# Altium schematic sheet mcu.SchDoc: Scalony Skaner Bioimpedancji
size A4; DrawnBy: Łukasz Przeniosło; Organization: Zachodniopomorski; Address1: Uniwersytet Technologiczny; Address2: w Szczecinie; Address3: Wydział Elektryczny; Address4: Katedra KISSE; Revision: 1.0; SheetNumber: 4; SheetTotal: 7
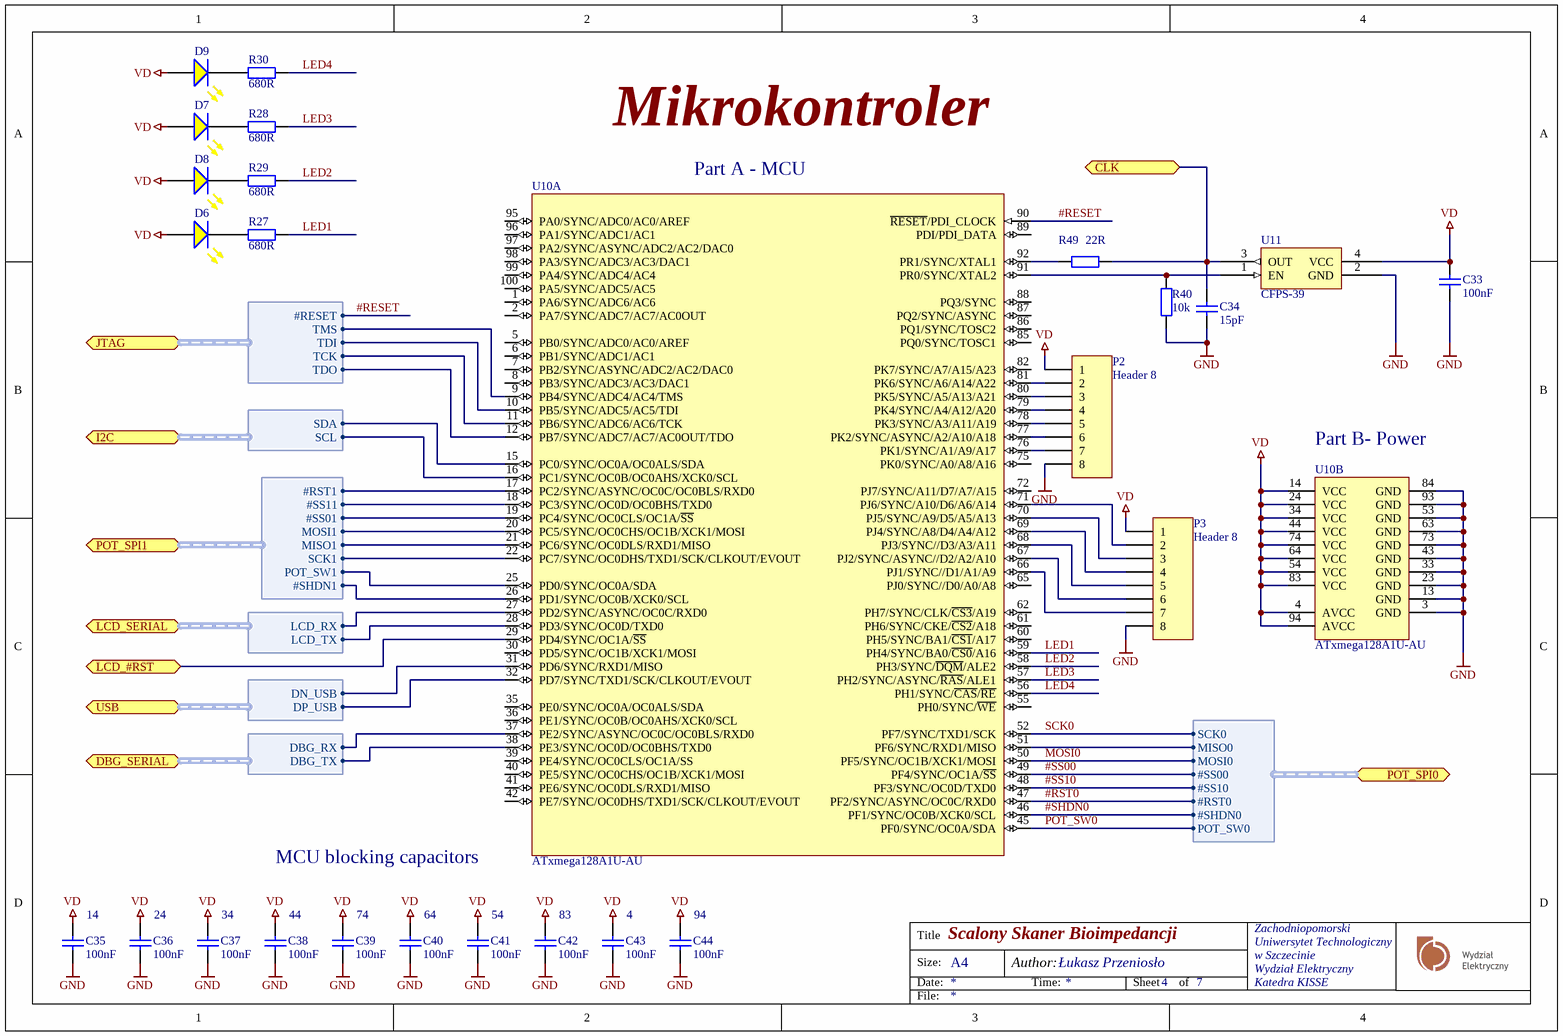
[diagram p0: mcu.SchDoc]

## Parts
C33  100nF  [CAPC1608N]
C34  15pF  [CAPC1608N]
C35  100nF  [CAPC1608N]
C36  100nF  [CAPC1608N]
C37  100nF  [CAPC1608N]
C38  100nF  [CAPC1608N]
C39  100nF  [CAPC1608N]
C40  100nF  [CAPC1608N]
C41  100nF  [CAPC1608N]
C42  100nF  [CAPC1608N]
C43  100nF  [CAPC1608N]
C44  100nF  [CAPC1608N]
D6  LED_YELLOW  [KPA-3010SGD]  (value not drawn)
D7  LED_YELLOW  [KPA-3010SGD]  (value not drawn)
D8  LED_YELLOW  [KPA-3010SGD]  (value not drawn)
D9  LED_YELLOW  [KPA-3010SGD]  (value not drawn)
P2  Header 8  [HDR1X8]
P3  Header 8  [HDR1X8]
R27  680R  [RESC1608N]
R28  680R  [RESC1608N]
R29  680R  [RESC1608N]
R30  680R  [RESC1608N]
R40  10k  [RESC1608N]
R49  22R  [RESC1608N]
U10  ATxmega128A1U-AU  [100A_MOJE]  (parts A,B of 2)
U11  CFPS-39  [ECX32]

## Ports
CLK, DBG_SERIAL (harness DBG_SERIAL), I2C (harness I2C), JTAG (harness JTAG), LCD_#RST, LCD_SERIAL (harness LCD_SERIAL), POT_SPI0 (harness POT_SPI0), POT_SPI1 (harness POT_SPI1), USB (harness USB)

## Harnesses
JTAG: TMS, TCK, TDI, TDO, #RESET
LCD_SERIAL: LCD_TX, LCD_RX
I2C: SDA, SCL
DBG_SERIAL: DBG_TX, DBG_RX
POT_SPI0: MISO0, MOSI0, SCK0, #SS00, #SS10, #RST0, #SHDN0, POT_SW0
USB: DP_USB, DN_USB
POT_SPI1: MISO1, MOSI1, SCK1, #SS01, #SS11, #RST1, #SHDN1, POT_SW1

## Nets
GND: C33.1 C34.1 C35.1 C36.1 C37.1 C38.1 C39.1 C40.1 C41.1 C42.1 C43.1 C44.1 P2.8 P3.8 R40.1 U10.3(GND) U10.13(GND) U10.23(GND) U10.33(GND) U10.43(GND) U10.53(GND) U10.63(GND) U10.73(GND) U10.84(GND) U10.93(GND) U11.2(GND)
VD: C33.2 C35.2 C36.2 C37.2 C38.2 C39.2 C40.2 C41.2 C42.2 C43.2 C44.2 D6.1(A) D7.1(A) D8.1(A) D9.1(A) P2.1 P3.1 U10.4(AVCC) U10.14(VCC) U10.24(VCC) U10.34(VCC) U10.44(VCC) U10.54(VCC) U10.64(VCC) U10.74(VCC) U10.83(VCC) U10.94(AVCC) U11.4(VCC)
#RESET: U10.90(~{RESET}/PDI_CLOCK) ; port JTAG.#RESET
#RST0: U10.47(PF2/SYNC/ASYNC/OC0C/RXD0) ; port POT_SPI0.#RST0
#SHDN0: U10.46(PF1/SYNC/OC0B/XCK0/SCL) ; port POT_SPI0.#SHDN0
#SS00: U10.49(PF4/SYNC/OC1A/~{SS}) ; port POT_SPI0.#SS00
#SS10: U10.48(PF3/SYNC/OC0D/TXD0) ; port POT_SPI0.#SS10
CLK: C34.2 R49.1 U11.3(OUT) ; port CLK
LCD_#RST: U10.29(PD4/SYNC/OC1A/~{SS}) ; port LCD_#RST
LED1: R27.1 U10.59(PH4/SYNC/BA0/~{CS0}/A16)
LED2: R29.1 U10.58(PH3/SYNC/~{DQM}/ALE2)
LED3: R28.1 U10.57(PH2/SYNC/ASYNC/~{RAS}/ALE1)
LED4: R30.1 U10.56(PH1/SYNC/~{CAS}/~{RE})
MOSI0: U10.50(PF5/SYNC/OC1B/XCK1/MOSI) ; port POT_SPI0.MOSI0
POT_SW0: U10.45(PF0/SYNC/OC0A/SDA) ; port POT_SPI0.POT_SW0
SCK0: U10.52(PF7/SYNC/TXD1/SCK) ; port POT_SPI0.SCK0
NetD6_2: D6.2(K) R27.2
NetD7_2: D7.2(K) R28.2
NetD8_2: D8.2(K) R29.2
NetD9_2: D9.2(K) R30.2
NetP2_2: P2.2 U10.81(PK6/SYNC/A6/A14/A22)
NetP2_3: P2.3 U10.80(PK5/SYNC/A5/A13/A21)
NetP2_4: P2.4 U10.79(PK4/SYNC/A4/A12/A20)
NetP2_5: P2.5 U10.78(PK3/SYNC/A3/A11/A19)
NetP2_6: P2.6 U10.77(PK2/SYNC/ASYNC/A2/A10/A18)
NetP2_7: P2.7 U10.76(PK1/SYNC/A1/A9/A17)
NetP3_2: P3.2 U10.71(PJ6/SYNC/A10/D6/A6/A14)
NetP3_3: P3.3 U10.70(PJ5/SYNC/A9/D5/A5/A13)
NetP3_4: P3.4 U10.69(PJ4/SYNC/A8/D4/A4/A12)
NetP3_5: P3.5 U10.68(PJ3/SYNC//D3/A3/A11)
NetP3_6: P3.6 U10.67(PJ2/SYNC/ASYNC//D2/A2/A10)
NetP3_7: P3.7 U10.66(PJ1/SYNC//D1/A1/A9)
NetR40_2: R40.2 U10.91(PR0/SYNC/XTAL2) U11.1(EN)
NetR49_2: R49.2 U10.92(PR1/SYNC/XTAL1)
NetU10_9: U10.9(PB4/SYNC/ADC4/AC4/TMS) ; port JTAG.TMS
NetU10_10: U10.10(PB5/SYNC/ADC5/AC5/TDI) ; port JTAG.TDI
NetU10_11: U10.11(PB6/SYNC/ADC6/AC6/TCK) ; port JTAG.TCK
NetU10_12: U10.12(PB7/SYNC/ADC7/AC7/AC0OUT/TDO) ; port JTAG.TDO
NetU10_15: U10.15(PC0/SYNC/OC0A/OC0ALS/SDA) ; port I2C.SDA
NetU10_16: U10.16(PC1/SYNC/OC0B/OC0AHS/XCK0/SCL) ; port I2C.SCL
NetU10_17: U10.17(PC2/SYNC/ASYNC/OC0C/OC0BLS/RXD0) ; port POT_SPI1.#RST1
NetU10_18: U10.18(PC3/SYNC/OC0D/OC0BHS/TXD0) ; port POT_SPI1.#SS11
NetU10_19: U10.19(PC4/SYNC/OC0CLS/OC1A/~{SS}) ; port POT_SPI1.#SS01
NetU10_20: U10.20(PC5/SYNC/OC0CHS/OC1B/XCK1/MOSI) ; port POT_SPI1.MOSI1
NetU10_21: U10.21(PC6/SYNC/OC0DLS/RXD1/MISO) ; port POT_SPI1.MISO1
NetU10_22: U10.22(PC7/SYNC/OC0DHS/TXD1/SCK/CLKOUT/EVOUT) ; port POT_SPI1.SCK1
NetU10_25: U10.25(PD0/SYNC/OC0A/SDA) ; port POT_SPI1.POT_SW1
NetU10_26: U10.26(PD1/SYNC/OC0B/XCK0/SCL) ; port POT_SPI1.#SHDN1
NetU10_27: U10.27(PD2/SYNC/ASYNC/OC0C/RXD0) ; port LCD_SERIAL.LCD_RX
NetU10_28: U10.28(PD3/SYNC/OC0D/TXD0) ; port LCD_SERIAL.LCD_TX
NetU10_31: U10.31(PD6/SYNC/RXD1/MISO) ; port USB.DN_USB
NetU10_32: U10.32(PD7/SYNC/TXD1/SCK/CLKOUT/EVOUT) ; port USB.DP_USB
NetU10_37: U10.37(PE2/SYNC/ASYNC/OC0C/OC0BLS/RXD0) ; port DBG_SERIAL.DBG_RX
NetU10_38: U10.38(PE3/SYNC/OC0D/OC0BHS/TXD0) ; port DBG_SERIAL.DBG_TX
NetU10_51: U10.51(PF6/SYNC/RXD1/MISO) ; port POT_SPI0.MISO0

Not connected (* = marked no-connect by the designer): U10 1(PA6/SYNC/ADC6/AC6) 2(PA7/SYNC/ADC7/AC7/AC0OUT) 5(PB0/SYNC/ADC0/AC0/AREF) 6(PB1/SYNC/ADC1/AC1) 7(PB2/SYNC/ASYNC/ADC2/AC2/DAC0) 8(PB3/SYNC/ADC3/AC3/DAC1) 30(PD5/SYNC/OC1B/XCK1/MOSI) 35(PE0/SYNC/OC0A/OC0ALS/SDA) 36(PE1/SYNC/OC0B/OC0AHS/XCK0/SCL) 39(PE4/SYNC/OC0CLS/OC1A/SS) 40(PE5/SYNC/OC0CHS/OC1B/XCK1/MOSI) 41(PE6/SYNC/OC0DLS/RXD1/MISO) 42(PE7/SYNC/OC0DHS/TXD1/SCK/CLKOUT/EVOUT) 55(PH0/SYNC/~{WE}) 60(PH5/SYNC/BA1/~{CS1}/A17) 61(PH6/SYNC/CKE/~{CS2}/A18) 62(PH7/SYNC/CLK/~{CS3}/A19) 65(PJ0/SYNC//D0/A0/A8) 72(PJ7/SYNC/A11/D7/A7/A15) 75(PK0/SYNC/A0/A8/A16) 82(PK7/SYNC/A7/A15/A23) 85(PQ0/SYNC/TOSC1) 86(PQ1/SYNC/TOSC2) 87(PQ2/SYNC/ASYNC) 88(PQ3/SYNC) 89(PDI/PDI_DATA) 95(PA0/SYNC/ADC0/AC0/AREF) 96(PA1/SYNC/ADC1/AC1) 97(PA2/SYNC/ASYNC/ADC2/AC2/DAC0) 98(PA3/SYNC/ADC3/AC3/DAC1) 99(PA4/SYNC/ADC4/AC4) 100(PA5/SYNC/ADC5/AC5)

## Notes on the sheet
- Mikrokontroler
- (near U10) Part A - MCU
- (near U10) Part B- Power
- (near C35) 14
- (near C36) 24
- (near C37) 34
- (near U10) MCU blocking capacitors
- (near C38) 44
- (near C39) 74
- (near C40) 64
- (near C41) 54
- (near C42) 83
- (near C43) 4
- (near C44) 94
- Title
- Size:
- Date:
- A4
- Author:
- Time:
- Sheet
- of
- File:

## Library data of the parts
C33-C44 = Capacitor
  C33 C35-C44: Value: 100nF
  C34: Value: 15pF
P2 P3 = Header 8: Header, 8-Pin; LatestRevisionDate: 17-Jul-2002; LatestRevisionNote: Re-released for DXP Platform.; Publisher: Altium Limited
R27-R30 R40 R49 = Resistor: Tolerance: 5%; Power: 0W
  R27-R30: Value: 680R
  R40: Value: 10k
  R49: Value: 22R
U10 = CMP-0094-00033-2: 8/16-bit AVR XMEGA A1 Microcontroller, 1.6-3.6V, 32MHz, 128KB + 8KB Flash, 2KB EEPROM, 8KB SRAM, 100-pin TQFP, Industrial Grade (-40°C to 85°C), Pb-Free; ComponentLink1Description: Manufacturer URL; Code_JEDEC: MS-026-AED; ComponentLink2Description: ATxmega64A1/128A1/192A1/256A1/384A1 Datasheet; PackageVersion: revD, Oct-2010; PackageDescription: 100-Pin Thin Profile Plastic Quad Flat Pack (TQFP), 14 x 14 x 1.0 mm Body, 0.5 mm Pitch; PackageReference: 100A; RevisionNote: DatasheetVersion & PackageVersion updated. URLs added.; DatasheetVersion: revM, Sep-2010; ComponentLink1URL: http://www.atmel.com/; ComponentLink2URL: http://www.atmel.com/dyn/resources/prod_documents/doc8067.pdf